# Altium schematic sheet MCU.SchDoc
size A4
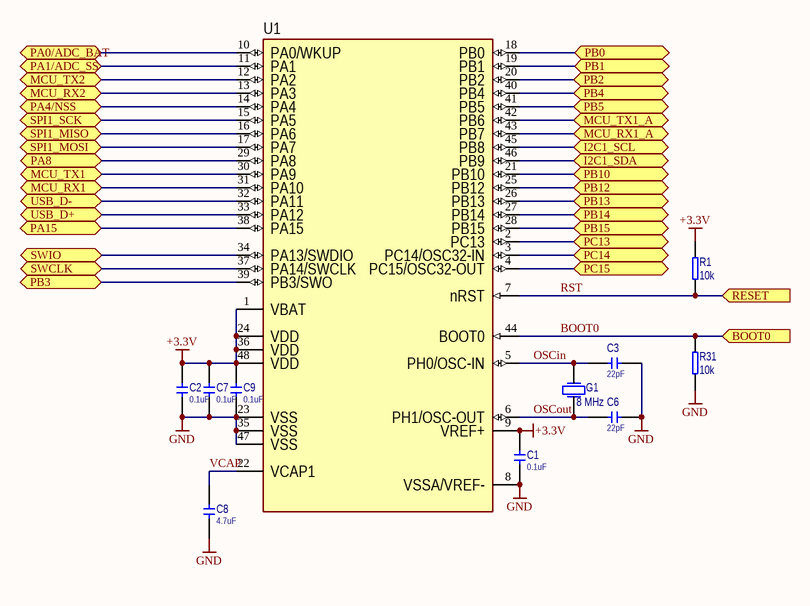
[diagram p0: MCU.SchDoc]

## Parts
C1  value 0.1uF  [CERCAP 0402]
C2  value 0.1uF  [CERCAP 0402]
C3  value 22pF  [CERCAP 0402]
C6  value 22pF  [CERCAP 0402]
C7  value 0.1uF  [CERCAP 0402]
C8  value 4.7uF  [CERCAP 0603]
C9  value 0.1uF  [CERCAP 0402]
G1  value 8 MHz  [3225]
R1  value 10k  [RES 0402]
R31  value 10k  [RES 0402]
U1  STM32F401CCU6  [QFN-48]  (value not drawn)

## Ports
BOOT0 (in), I2C1_SCL (bidir), I2C1_SDA (bidir), MCU_RX1 (bidir), MCU_RX1_A (bidir), MCU_RX2 (bidir), MCU_TX1 (bidir), MCU_TX1_A (bidir), MCU_TX2 (bidir), PA0/ADC_BAT (bidir), PA1/ADC_SS (bidir), PA4/NSS (bidir), PA8 (bidir), PA15 (bidir), PB0 (bidir), PB1 (bidir), PB2 (bidir), PB3 (bidir), PB4 (bidir), PB5 (bidir), PB10 (bidir), PB12 (bidir), PB13 (bidir), PB14 (bidir), PB15 (bidir), PC13 (bidir), PC14 (bidir), PC15 (bidir), RESET (in), SPI1_MISO (bidir), SPI1_MOSI (bidir), SPI1_SCK (bidir), SWCLK (bidir), SWIO (bidir), USB_D+ (bidir), USB_D- (bidir)

## Nets
+3.3V: C1.2 C2.2 C7.2 C9.2 R1.2 U1.1(VBAT) U1.9(VREF+) U1.24(VDD) U1.36(VDD) U1.48(VDD)
GND: C1.1 C2.1 C3.1 C6.1 C7.1 C8.1 C9.1 R31.2 U1.8(VSSA/VREF-) U1.23(VSS) U1.35(VSS) U1.47(VSS)
BOOT0: R31.1 U1.44(BOOT0) ; port BOOT0
I2C1_SCL: U1.45(PB8) ; port I2C1_SCL
I2C1_SDA: U1.46(PB9) ; port I2C1_SDA
MCU_RX1: U1.31(PA10) ; port MCU_RX1
MCU_RX1_A: U1.43(PB7) ; port MCU_RX1_A
MCU_RX2: U1.13(PA3) ; port MCU_RX2
MCU_TX1: U1.30(PA9) ; port MCU_TX1
MCU_TX1_A: U1.42(PB6) ; port MCU_TX1_A
MCU_TX2: U1.12(PA2) ; port MCU_TX2
OSCin: C3.2 G1.2 U1.5(PH0/OSC-IN)
OSCout: C6.2 G1.1 U1.6(PH1/OSC-OUT)
PA0/ADC_BAT: U1.10(PA0/WKUP) ; port PA0/ADC_BAT
PA1/ADC_SS: U1.11(PA1) ; port PA1/ADC_SS
PA4/NSS: U1.14(PA4) ; port PA4/NSS
PA8: U1.29(PA8) ; port PA8
PA15: U1.38(PA15) ; port PA15
PB0: U1.18(PB0) ; port PB0
PB1: U1.19(PB1) ; port PB1
PB2: U1.20(PB2) ; port PB2
PB3: U1.39(PB3/SWO) ; port PB3
PB4: U1.40(PB4) ; port PB4
PB5: U1.41(PB5) ; port PB5
PB10: U1.21(PB10) ; port PB10
PB12: U1.25(PB12) ; port PB12
PB13: U1.26(PB13) ; port PB13
PB14: U1.27(PB14) ; port PB14
PB15: U1.28(PB15) ; port PB15
PC13: U1.2(PC13) ; port PC13
PC14: U1.3(PC14/OSC32-IN) ; port PC14
PC15: U1.4(PC15/OSC32-OUT) ; port PC15
RST: R1.1 U1.7(nRST) ; port RESET
SPI1_MISO: U1.16(PA6) ; port SPI1_MISO
SPI1_MOSI: U1.17(PA7) ; port SPI1_MOSI
SPI1_SCK: U1.15(PA5) ; port SPI1_SCK
SWCLK: U1.37(PA14/SWCLK) ; port SWCLK
SWIO: U1.34(PA13/SWDIO) ; port SWIO
USB_D+: U1.33(PA12) ; port USB_D+
USB_D-: U1.32(PA11) ; port USB_D-
VCAP: C8.2 U1.22(VCAP1)

## Library data of the parts
C1-C3 C6-C9 = !Capacitor: Capacitor; IsSMT: NoSMT; Diel: X7R; Voltage: *
G1 = Crystal: pin to pad: 2>3; IsSMT: NoSMT
R1 R31 = !Resistor: Resistor; IsSMT: NoSMT
U1 = STM32F401CCU6: Cortex-M4